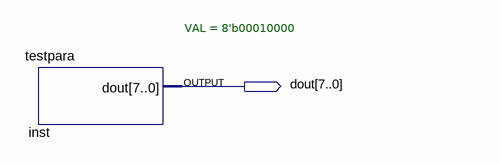
[diagram p0: schematic sheet]
// Quartus schematic Block1.bdf as structural Verilog: 1 symbols, 1 pins
module Block1 (
  output [7:0] dout
);

  testpara #(.VAL(8'b00010000)) inst (.dout(dout));
endmodule
